# Altium schematic sheet Demo_git_AltiumDesigner.SchDoc
size A4
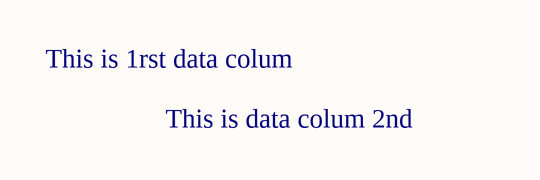
[diagram p0: Demo_git_AltiumDesigner.SchDoc]

## Notes on the sheet
- This is 1rst data colum
- This is data colum 2nd